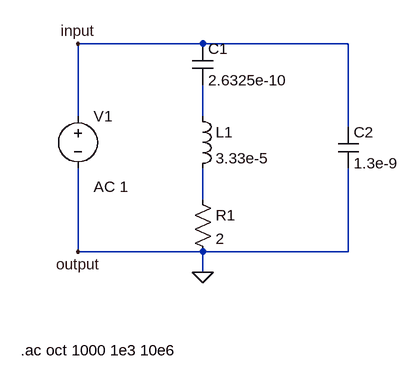
[diagram p0: schematic BVD_V1.asc]
BVD_V1.asc, the LTspice schematic file:
Version 4
SHEET 1 880 680
WIRE 128 -128 -64 -128
WIRE 352 -128 128 -128
WIRE -64 -16 -64 -128
WIRE 128 -16 128 -64
WIRE 352 0 352 -128
WIRE 128 112 128 64
WIRE -64 192 -64 64
WIRE 128 192 -64 192
WIRE 352 192 352 64
WIRE 352 192 128 192
WIRE 128 224 128 192
FLAG 128 224 0
FLAG -64 -128 input
FLAG -64 192 output
SYMBOL res 112 96 R0
SYMATTR InstName R1
SYMATTR Value 2
SYMBOL ind 112 -32 R0
SYMATTR InstName L1
SYMATTR Value 3.33e-5
SYMBOL cap 112 -128 R0
SYMATTR InstName C1
SYMATTR Value 2.6325e-10
SYMBOL cap 336 0 R0
SYMATTR InstName C2
SYMATTR Value 1.3e-9
SYMBOL voltage -64 -32 R0
WINDOW 123 24 124 Left 2
WINDOW 39 0 0 Left 0
SYMATTR Value2 AC 1
SYMATTR InstName V1
SYMATTR Value ""
TEXT -152 344 Left 2 !.ac oct 1000 1e3 10e6

The netlist it stands for:
* BVD_V1.asc
R1 N002 0 2
L1 N001 N002 3.33e-5
C1 input N001 2.6325e-10
C2 input 0 1.3e-9
V1 input 0 AC 1
.ac oct 1000 1e3 10e6
.backanno
.end